# EasyEDA schematic 1-Schematic_ESP32 expandable Power.json
TITLE: New Schematic; REV: 1.0; Date: 2018-11-03; Sheet: 1/1; Drawn By: jirka.svitil
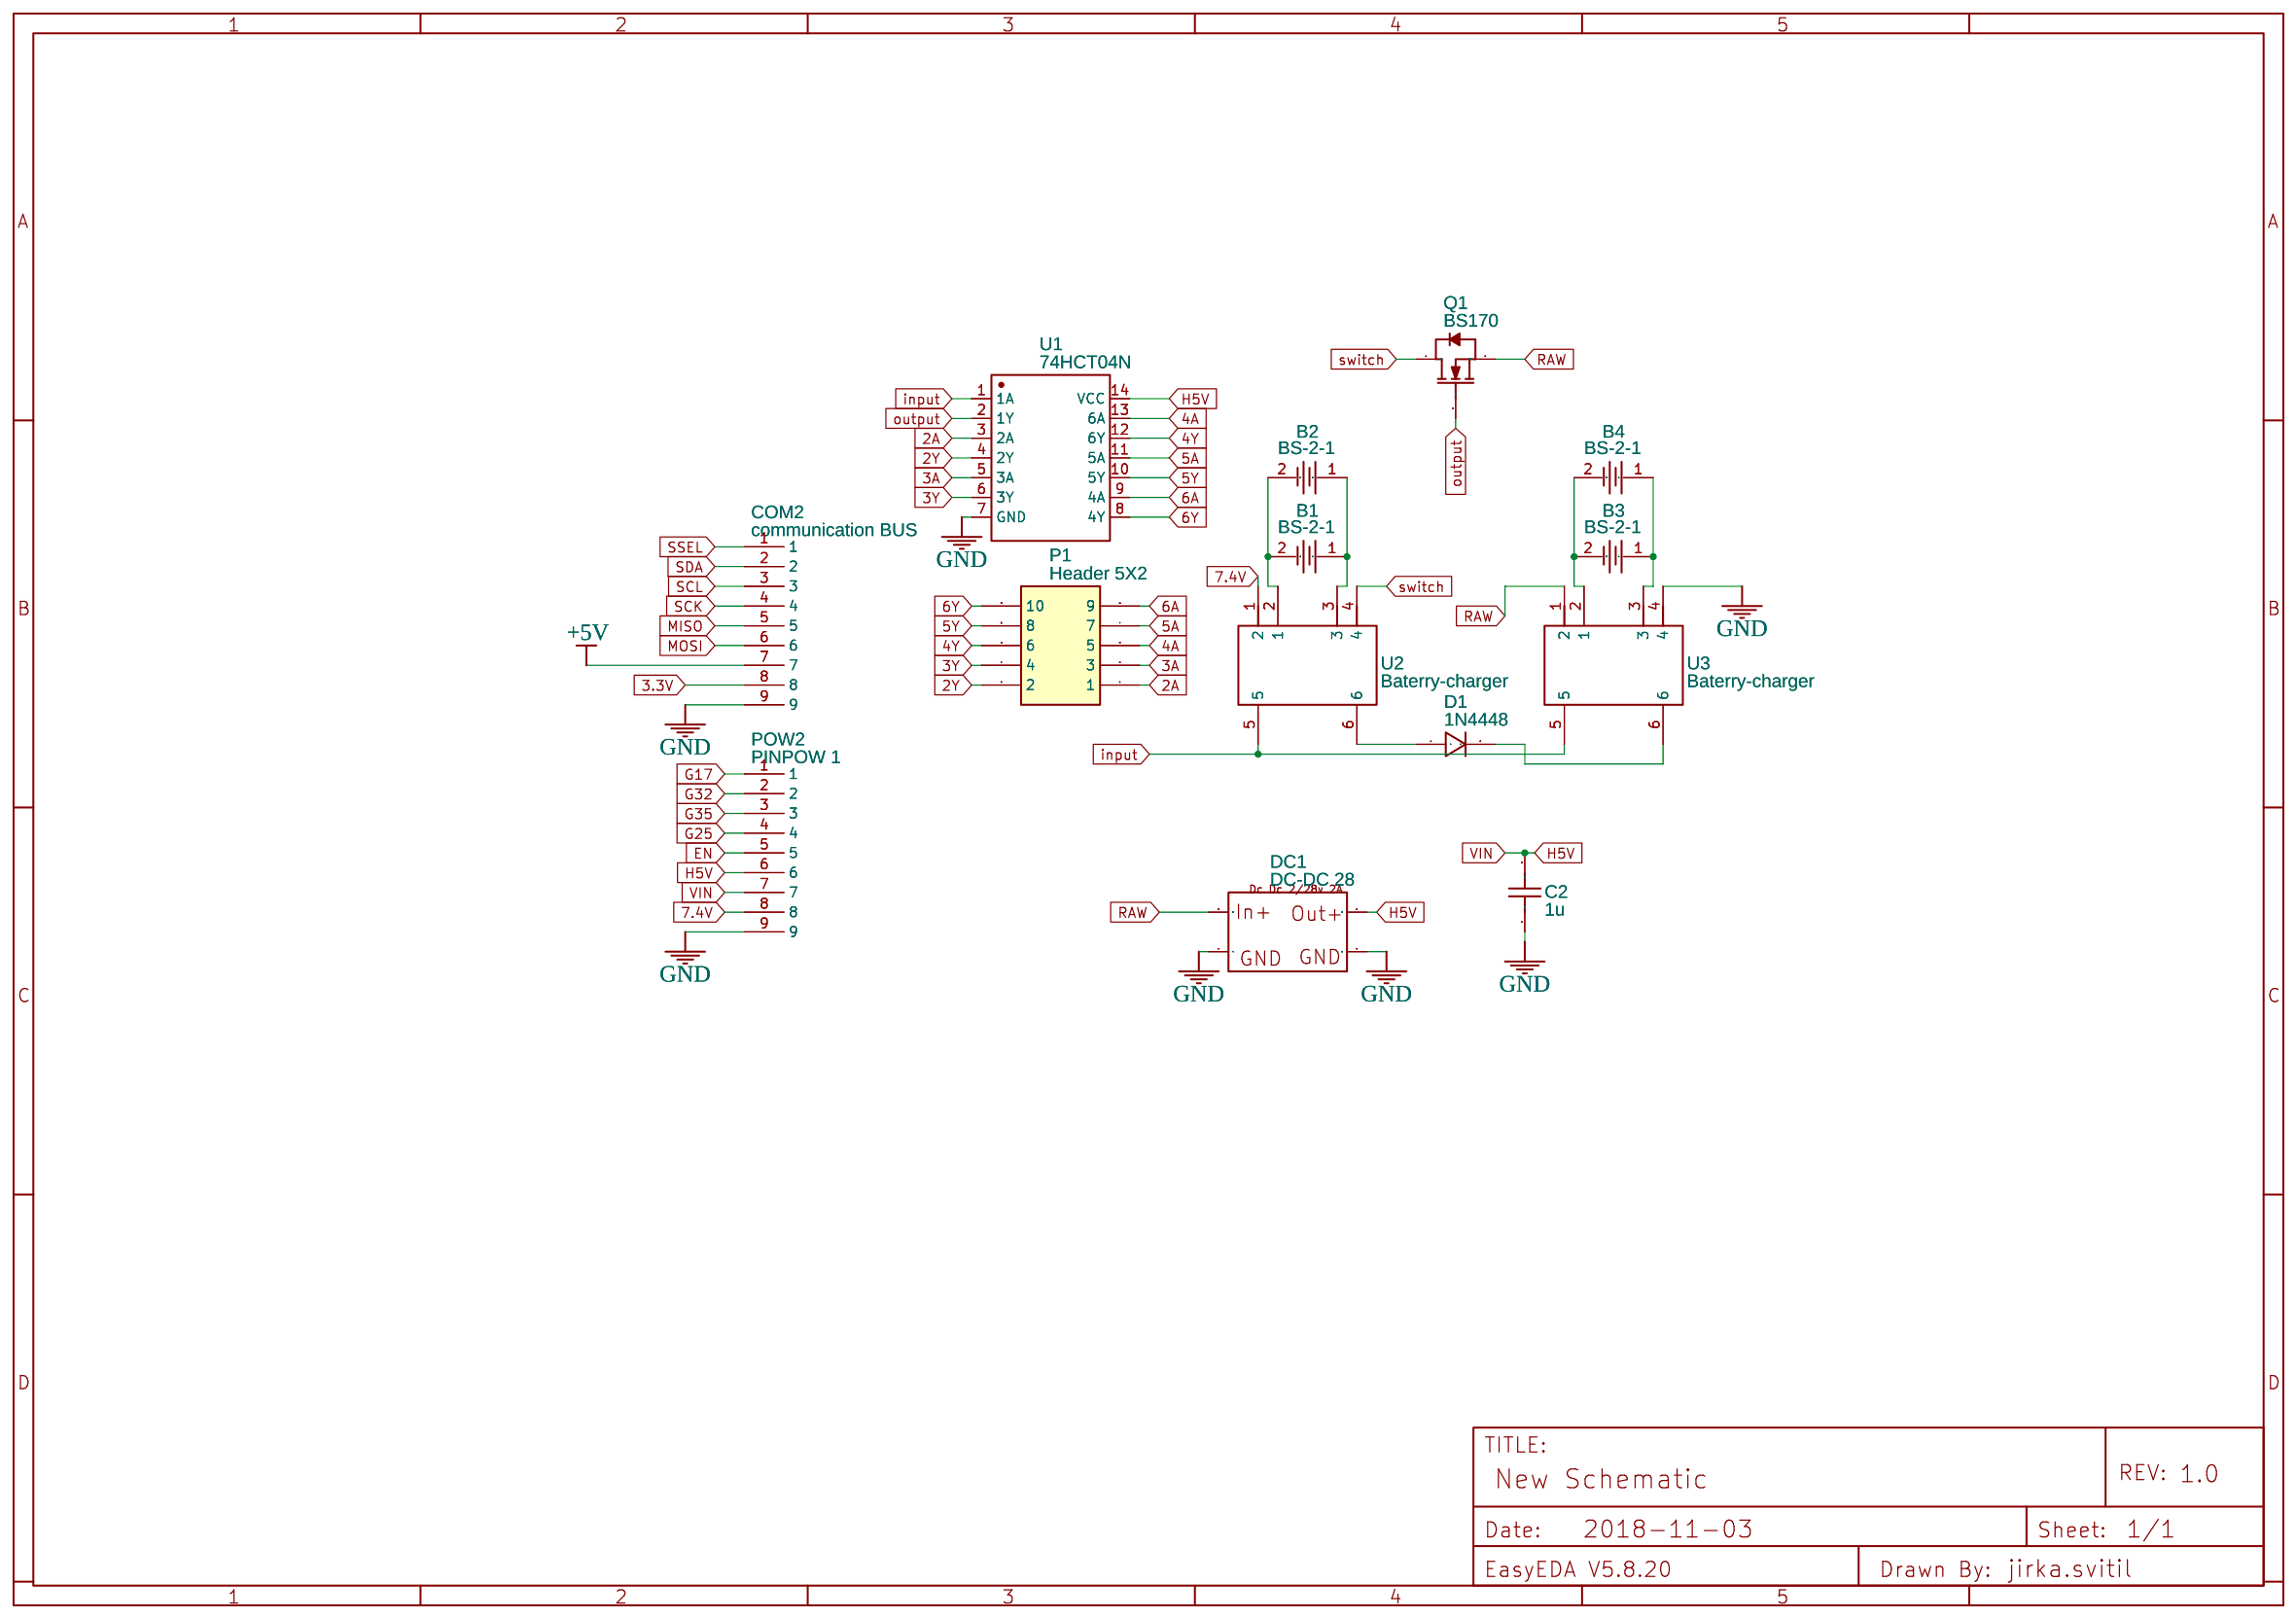
[diagram p0: schematic sheet]

## Parts
B1  BS-2-1  [HDR-2X1/2.54]
B2  BS-2-1  [HDR-2X1/2.54]
B3  BS-2-1  [HDR-2X1/2.54]
B4  BS-2-1  [HDR-2X1/2.54]
C2  1u  [RAD-0.1]
COM2  communication BUS  [9PIN HEADER]
D1  1N4448  [DO-35]
DC1  DC-DC 28  [DC-DC SX1308 2A]
P1  Header 5X2  [HDR2X5]
POW2  PINPOW 1  [9PIN HEADER]
Q1  BS170  [TO-92]
U1  74HCT04N  [DIP14]
U2  Baterry-charger  [TP4056_K]
U3  Baterry-charger  [TP4056_K]

## Library data of the parts
B1-B4 = -: Supplier: LCSC; Manufacturer: Q&J; image: //image.lceda.cn/szlcsc/C70376.jpg; Supplier Part: C70376
C2 = Cap_RAD-0.1_US: Manufacturer Part: ?
COM2 POW2 = -: Contributor: raptordemon; sourceId: 9RqCAyiSr; Manufacturer Part: ?
D1 = -: Supplier: LCSC; Manufacturer: SEMTECH; image: //image.lceda.cn/szlcsc/C54037.jpg; Supplier Part: C54037
DC1 = DC-DC 28: Mounted: Yes; Manufacturer Part: ?
P1 = -: Header, 5-Pin, Dual row; Manufacturer Part: ?
Q1 = -: Supplier: LCSC; Manufacturer: FAIRCHILD; Contributor: LCSC; Supplier Part: C111691
U1 = -: Manufacturer Part: ?
U2 U3 = -: Manufacturer Part: New SchematicLib; Contributor: Jirka Svítil

## Nets
3.3V: COM2.8
7.4V: POW2.8 U2.1(2)
+5V: COM2.7
GND: C2.1 COM2.9 DC1.2 DC1.4 POW2.9 U1.7(GND) U3.4
2A: P1.1 U1.3(2A)
2Y: P1.2 U1.4(2Y)
3A: P1.3 U1.5(3A)
3Y: P1.4 U1.6(3Y)
4A: P1.5 U1.13(6A)
4Y: P1.6 U1.12(6Y)
5A: P1.7 U1.11(5A)
5Y: P1.8 U1.10(5Y)
6A: P1.9 U1.9(4A)
6Y: P1.10 U1.8(4Y)
EN: POW2.5
G17: POW2.1
G25: POW2.4
G32: POW2.2
G35: POW2.3
H5V: C2.2 DC1.1 POW2.6 POW2.7 U1.14(VCC)
input: U1.1(1A) U2.5 U3.5
MISO: COM2.5
MOSI: COM2.6
output: Q1.2(G) U1.2(1Y)
RAW: DC1.3 Q1.3(S) U3.1(2)
SCK: COM2.4
SCL: COM2.3
SDA: COM2.2
SSEL: COM2.1
switch: Q1.1(D) U2.4
D1_2: D1.2(K) U3.6
U2_2: B1.2 B2.2 U2.2(1)
U2_3: B1.1 B2.1 U2.3
U2_6: D1.1(A) U2.6
U3_2: B3.2 B4.2 U3.2(1)
U3_3: B3.1 B4.1 U3.3
